# Altium schematic sheet audio.SchDoc
size A3
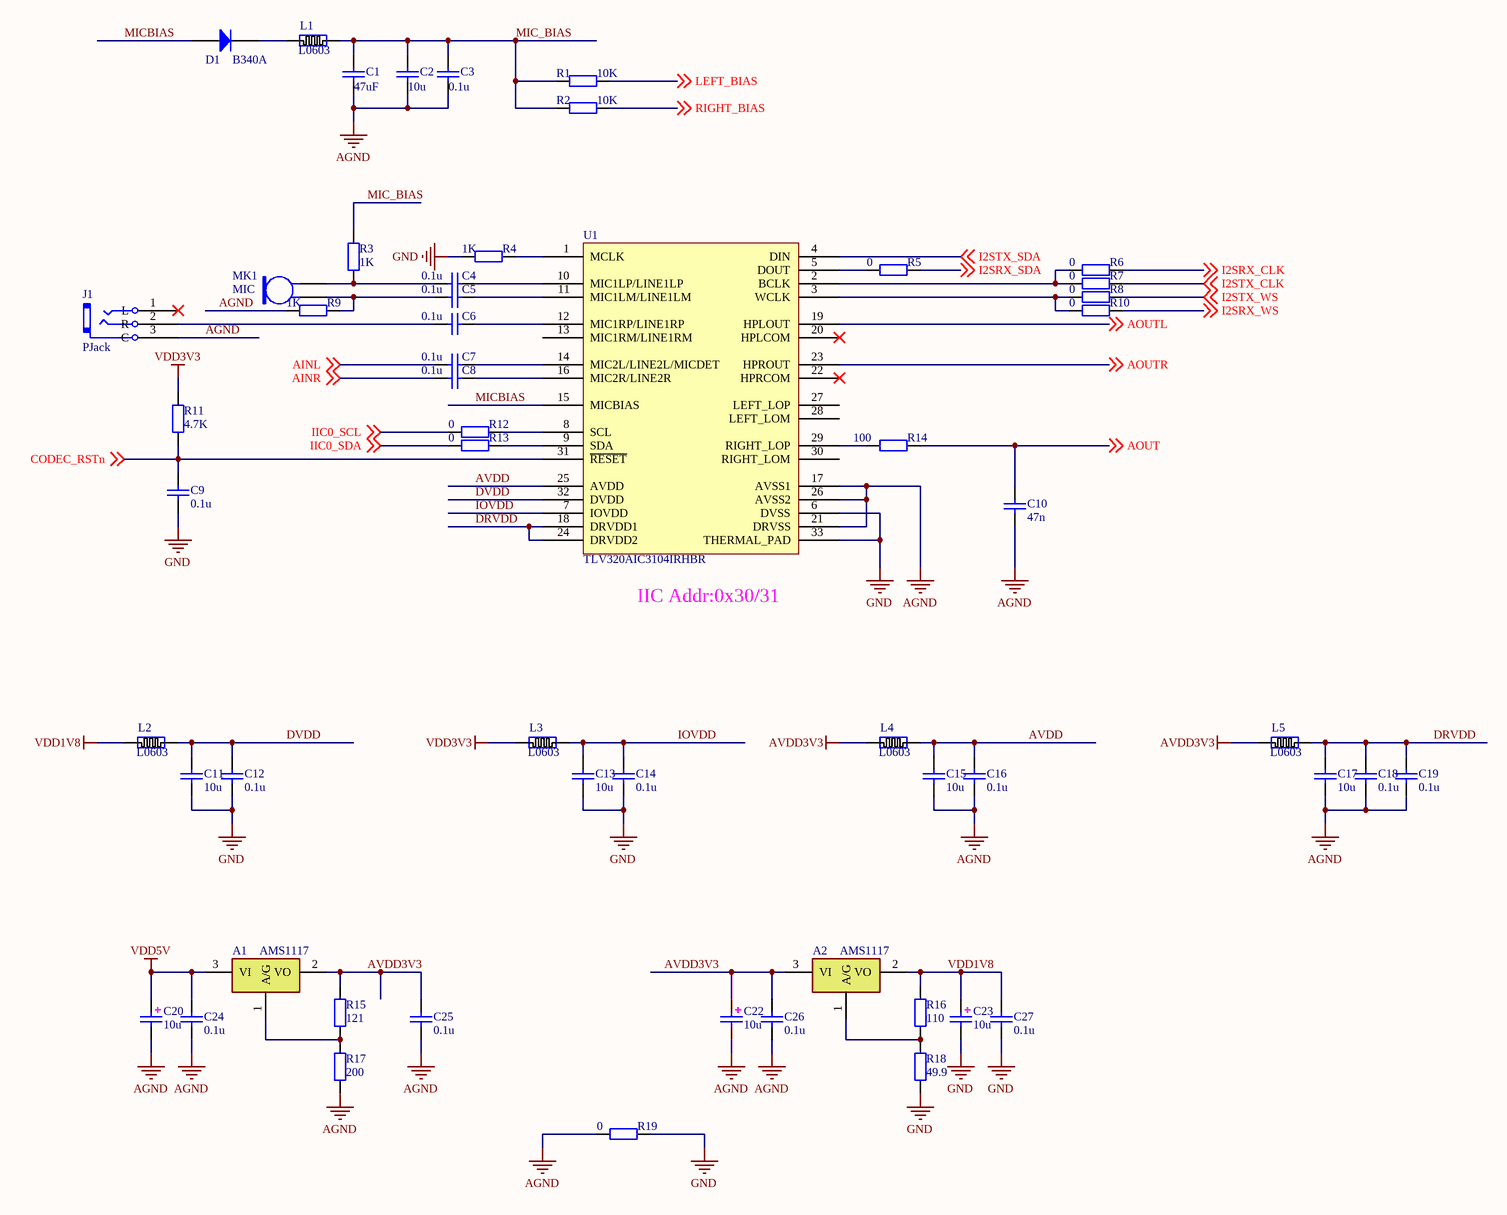
[diagram p0: audio.SchDoc]

## Parts
A1  AMS1117  [ASM1117-A]
A2  AMS1117  [ASM1117-A]
C1  47uF  [C0805]
C2  10u  [C0603]
C3  0.1u  [C0603]
C4  0.1u  [C0603]
C5  0.1u  [C0603]
C6  0.1u  [C0603]
C7  0.1u  [C0603]
C8  0.1u  [C0603]
C9  0.1u  [C0603]
C10  47n  [C0603]
C11  10u  [C0603]
C12  0.1u  [C0603]
C13  10u  [C0603]
C14  0.1u  [C0603]
C15  10u  [C0603]
C16  0.1u  [C0603]
C17  10u  [C0603]
C18  0.1u  [C0603]
C19  0.1u  [C0603]
C20  10u  [C1210]
C22  10u  [C1210]
C23  10u  [C1210]
C24  0.1u  [C0603]
C25  0.1u  [C0603]
C26  0.1u  [C0603]
C27  0.1u  [C0603]
D1  B340A  [D2112]
J1  PJack  [ADIO]
L1  L0603  [L0603]
L2  L0603  [L0603]
L3  L0603  [L0603]
L4  L0603  [L0603]
L5  L0603  [L0603]
MK1  MIC  [MIC]
R1  10K  [R0603]
R2  10K  [R0603]
R3  1K  [R0603]
R4  1K  [R0603]
R5  0  [R0603]
R6  0  [R0603]
R7  0  [R0603]
R8  0  [R0603]
R9  1K  [R0603]
R10  0  [R0603]
R11  4.7K  [R0603]
R12  0  [R0603]
R13  0  [R0603]
R14  100  [R0603]
R15  121  [R0603]
R16  110  [R0603]
R17  200  [R0603]
R18  49.9  [R0603]
R19  0  [R0603]
U1  TLV320AIC3104IRHBR  [QFN33-I20-200200]

## Nets
AGND: C1.1 C2.1 C3.1 C10.1 C15.1 C16.1 C17.1 C18.1 C19.1 C20.2 C22.2 C24.1 C25.1 C26.1 J1.3(C) R9.2 R17.1 R19.1 U1.17(AVSS1) U1.21(DRVSS) U1.26(AVSS2)
AVDD3V3: A1.2(VO) A2.3(VI) C22.1 C25.2 C26.2 L4.1 L5.1 R15.2
GND: C9.1 C11.1 C12.1 C13.1 C14.1 C23.2 C27.1 R4.1 R18.1 R19.2 U1.6(DVSS) U1.33(THERMAL_PAD)
VDD1V8: A2.2(VO) C23.1 C27.2 L2.1 R16.2
VDD3V3: L3.1 R11.1
VDD5V: A1.3(VI) C20.1 C24.2
AINL: C7.2 ; off-sheet AINL
AINR: C8.2 ; off-sheet AINR
AOUT: C10.2 R14.2 ; off-sheet AOUT
AOUTL: U1.19(HPLOUT) ; off-sheet AOUTL
AOUTR: U1.23(HPROUT) ; off-sheet AOUTR
AVDD: C15.2 C16.2 L4.2 U1.25(AVDD)
CODEC_RSTn: C9.2 R11.2 U1.31(~{RESET}) ; off-sheet CODEC_RSTn
DRVDD: C17.2 C18.2 C19.2 L5.2 U1.18(DRVDD1) U1.24(DRVDD2)
DVDD: C11.2 C12.2 L2.2 U1.32(DVDD)
I2SRX_CLK: R6.2 ; off-sheet I2SRX_CLK
I2SRX_SDA: R5.2 ; off-sheet I2SRX_SDA
I2SRX_WS: R10.2 ; off-sheet I2SRX_WS
I2STX_CLK: R7.2 ; off-sheet I2STX_CLK
I2STX_SDA: U1.4(DIN) ; off-sheet I2STX_SDA
I2STX_WS: R8.2 ; off-sheet I2STX_WS
IIC0_SCL: R12.1 ; off-sheet IIC0_SCL
IIC0_SDA: R13.1 ; off-sheet IIC0_SDA
IOVDD: C13.2 C14.2 L3.2 U1.7(IOVDD)
LEFT_BIAS: R1.1 ; off-sheet LEFT_BIAS
MIC_BIAS: C1.2 C2.2 C3.2 L1.2 R1.2 R2.2 R3.2
MICBIAS: D1.A U1.15(MICBIAS)
RIGHT_BIAS: R2.1 ; off-sheet RIGHT_BIAS
NetA1_1: A1.1(A/G) R15.1 R17.2
NetA2_1: A2.1(A/G) R16.1 R18.2
NetC4_1: C4.1 U1.10(MIC1LP/LINE1LP)
NetC4_2: C4.2 MK1.2 R3.1
NetC5_1: C5.1 U1.11(MIC1LM/LINE1LM)
NetC5_2: C5.2 MK1.1 R9.1
NetC6_1: C6.1 U1.12(MIC1RP/LINE1RP)
NetC6_2: C6.2 J1.2(R)
NetC7_1: C7.1 U1.14(MIC2L/LINE2L/MICDET)
NetC8_1: C8.1 U1.16(MIC2R/LINE2R)
NetD1_K: D1.K L1.1
NetR4_2: R4.2 U1.1(MCLK)
NetR5_1: R5.1 U1.5(DOUT)
NetR6_1: R6.1 R7.1 U1.2(BCLK)
NetR8_1: R8.1 R10.1 U1.3(WCLK)
NetR12_2: R12.2 U1.8(SCL)
NetR13_2: R13.2 U1.9(SDA)
NetR14_1: R14.1 U1.29(RIGHT_LOP)

Not connected (* = marked no-connect by the designer): J1 1(L)*; U1 13(MIC1RM/LINE1RM) 20(HPLCOM)* 22(HPRCOM)* 27(LEFT_LOP) 28(LEFT_LOM) 30(RIGHT_LOM)

## Notes on the sheet
- (near U1) IIC Addr:0x30/31

## Library data of the parts
A1 A2 = AMS1117: 1117 LDO
C1-C19 C24-C27 = CAP0603: 0603 Capacitor without Polarity
C20 C22 C23 = DCAP: 钽电容1210封装
J1 = PJack: 3.5mm EPhone Jack
L1-L5 = L0603: 0603 Inductor
MK1 = MICROPHONE
R1-R19 = RES0603: 0603 Resistor
U1 = TLV320AIC3104IRHBR: TI AUDIO CODEC